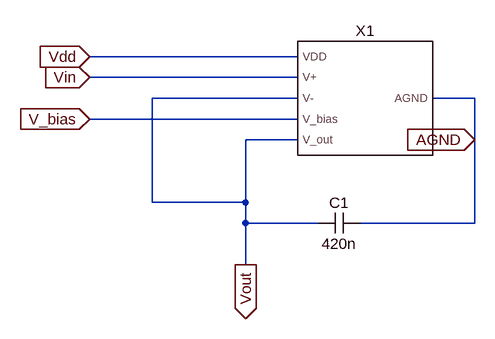
[diagram p0: schematic lp_slow.asc]
lp_slow.asc, the LTspice schematic file:
Version 4.1
SHEET 1 880 680
WIRE 112 112 -208 112
WIRE 112 144 -208 144
WIRE 112 176 -112 176
WIRE 384 176 320 176
WIRE 112 208 -208 208
WIRE 112 240 32 240
WIRE 384 240 384 176
WIRE -112 336 -112 176
WIRE 32 336 32 240
WIRE 32 336 -112 336
WIRE 32 368 32 336
WIRE 144 368 32 368
WIRE 384 368 384 240
WIRE 384 368 208 368
WIRE 32 432 32 368
FLAG -208 144 Vin
IOPIN -208 144 In
FLAG 32 432 Vout
IOPIN 32 432 Out
FLAG -208 112 Vdd
IOPIN -208 112 In
FLAG -208 208 V_bias
IOPIN -208 208 In
FLAG 384 240 AGND
IOPIN 384 240 In
SYMBOL cap 208 352 R90
WINDOW 0 0 32 VBottom 2
WINDOW 3 32 32 VTop 2
SYMATTR InstName C1
SYMATTR Value 420n
SYMBOL ota_core 208 176 R0
SYMATTR InstName X1

The netlist it stands for:
* lp_slow.asc
C1 AGND Vout 420n
X§X1 Vdd Vin Vout V_bias Vout AGND ota_core  ; pins VDD V+ V- V_bias V_out AGND
.backanno
.end